# Altium project 10-Channel SPI Sensing Circuit.PrjPcb
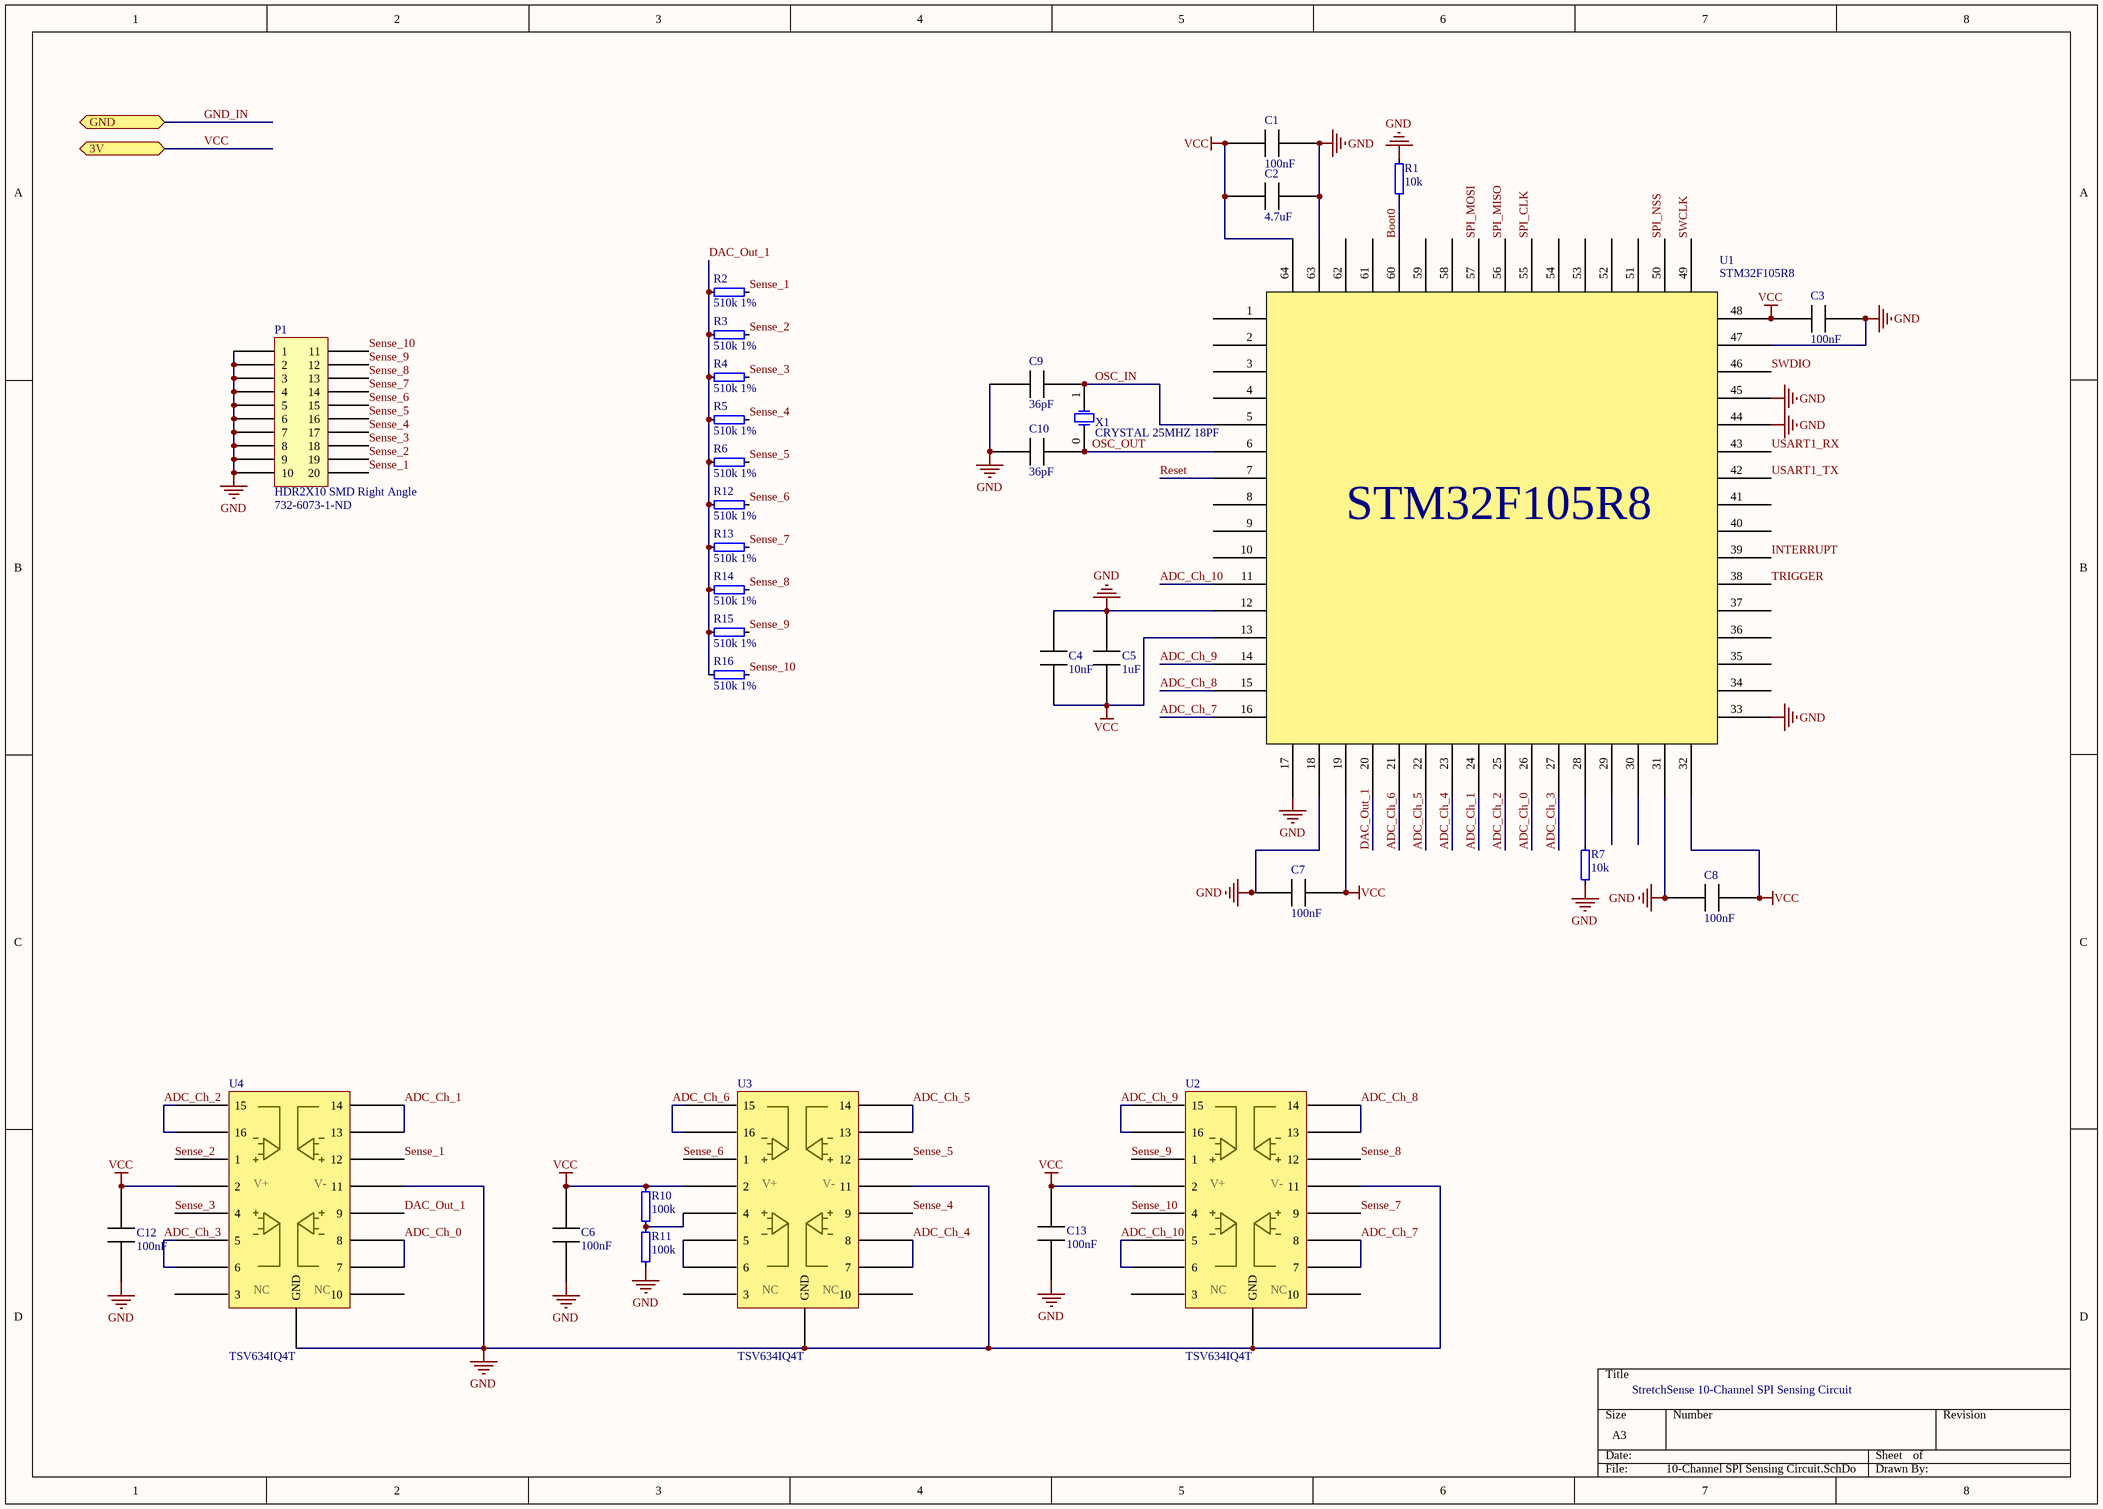
[diagram p0: 10-Channel SPI Sensing Circuit.SchDoc]
1 sheet, 32 parts. Net scope: flat (ports and power ports of the same name join across sheets).
Board file: 10-Channel SPI Sensing Circuit.PcbDoc

## Sheet 10-Channel SPI Sensing Circuit.SchDoc: StretchSense 10-Channel SPI Sensing Circuit
size A3; Revision: 1.0; PageSetup: Record=PageOptions|CenterHorizontal=True|CenterVertical=True|PrintScale=0.71|XCorrection=1.00|YCorrection=1.00|PrintKind=0|BorderSize=5000000|LeftOffset=0|BottomOffset=0|Orientation=2|PaperLength=1000|PaperWidth=1000|Scale=100|PaperSource=7|PrintQuality=600|MediaType=1|DitherType=10|PrintScaleMode=1|PaperKind=A4

### Parts
C1  100nF  [0402 Cap]
C2  4.7uF  [0402 Cap]
C3  100nF  [0402 Cap]
C4  10nF  [0402 Cap]
C5  1uF  [0402 Cap]
C6  100nF  [0402 Cap]
C7  100nF  [0402 Cap]
C8  100nF  [0402 Cap]
C9  36pF  [0402 Cap]
C10  36pF  [0402 Cap]
C12  100nF  [0402 Cap]
C13  100nF  [0402 Cap]
P1  HDR2X10 SMD Right Angle  Supplier Part Number 1: 732-6073-1-ND  [HDR2X10 SMD RIGHT]
R1  10k  [0402 Res]
R2  510k 1%  [0402 Res]
R3  510k 1%  [0402 Res]
R4  510k 1%  [0402 Res]
R5  510k 1%  [0402 Res]
R6  510k 1%  [0402 Res]
R7  10k  [0402 Res]
R10  100k  [0402 Res]
R11  100k  [0402 Res]
R12  510k 1%  [0402 Res]
R13  510k 1%  [0402 Res]
R14  510k 1%  [0402 Res]
R15  510k 1%  [0402 Res]
R16  510k 1%  [0402 Res]
U1  STM32F105R8  [STM32F105R8]
U2  TSV634IQ4T  [QFN-16]
U3  TSV634IQ4T  [QFN-16]
U4  TSV634IQ4T  [QFN-16]
X1  CRYSTAL 25MHZ 18PF  [CRYSTAL 24MHZ 18PF SMD]

### Ports
3V, GND

### Nets
GND: C1.2 C2.2 C3.2 C4.2 C5.1 C6.1 C7.1 C8.1 C9.2 C10.2 C12.1 C13.1 P1.1 P1.2 P1.3 P1.4 P1.5 P1.6 P1.7 P1.8 P1.9 P1.10 R1.1 R7.2 R11.1 U1.12(Pin12) U1.17(Pin17) U1.18(Pin18) U1.31(Pin31) U1.33(Pin33) U1.44(Pin44) U1.45(Pin45) U1.47(Pin47) U1.63(Pin63) U2.11 U2.17(GND) U3.11 U3.17(GND) U4.11 U4.17(GND)
VCC: C1.1 C2.1 C3.1 C4.1 C5.2 C6.2 C7.2 C8.2 C12.2 C13.2 R10.2 U1.13(Pin13) U1.19(Pin19) U1.32(Pin32) U1.48(Pin48) U1.64(Pin64) U2.2 U3.2 U4.2 ; port 3V
ADC_Ch_0: U1.26(Pin26) U4.7 U4.8
ADC_Ch_1: U1.24(Pin24) U4.13 U4.14
ADC_Ch_2: U1.25(Pin25) U4.15 U4.16
ADC_Ch_3: U1.27(Pin27) U4.5 U4.6
ADC_Ch_4: U1.23(Pin23) U3.7 U3.8
ADC_Ch_5: U1.22(Pin22) U3.13 U3.14
ADC_Ch_6: U1.21(Pin21) U3.15 U3.16
ADC_Ch_7: U1.16(Pin16) U2.7 U2.8
ADC_Ch_8: U1.15(Pin15) U2.13 U2.14
ADC_Ch_9: U1.14(Pin14) U2.15 U2.16
ADC_Ch_10: U1.11(Pin11) U2.5 U2.6
Boot0: R1.2 U1.60(Pin60)
DAC_Out_1: R2.2 R3.2 R4.2 R5.2 R6.2 R12.1 R13.1 R14.1 R15.1 R16.1 U1.20(Pin20) U4.9
GND_IN: port GND
INTERRUPT: U1.39(Pin39)
OSC_IN: C9.1 U1.5(Pin5) X1.1(OSC_IN)
OSC_OUT: C10.1 U1.6(Pin6) X1.0
Reset: U1.7(Pin7)
Sense_1: P1.20 R2.1 U4.12
Sense_2: P1.19 R3.1 U4.1
Sense_3: P1.18 R4.1 U4.4
Sense_4: P1.17 R5.1 U3.9
Sense_5: P1.16 R6.1 U3.12
Sense_6: P1.15 R12.2 U3.1
Sense_7: P1.14 R13.2 U2.9
Sense_8: P1.13 R14.2 U2.12
Sense_9: P1.12 R15.2 U2.1
Sense_10: P1.11 R16.2 U2.4
SPI_CLK: U1.55(Pin55)
SPI_MISO: U1.56(Pin56)
SPI_MOSI: U1.57(Pin57)
SPI_NSS: U1.50(Pin50)
SWCLK: U1.49(Pin49)
SWDIO: U1.46(Pin46)
TRIGGER: U1.38(Pin38)
USART1_RX: U1.43(Pin43)
USART1_TX: U1.42(Pin42)
NetR7_1: R7.1 U1.28(Pin28)
NetR10_1: R10.1 R11.2 U3.4
NetU3_5: U3.5 U3.6

Not connected (* = marked no-connect by the designer): U1 1(Pin1) 2(Pin2) 3(Pin3) 4(Pin4) 8(Pin8) 9(Pin9) 10(Pin10) 29(Pin29) 30(Pin30) 34(Pin34) 35(Pin35) 36(Pin36) 37(Pin37) 40(Pin40) 41(Pin41) 51(Pin51) 52(Pin52) 53(Pin53) 54(Pin54) 58(Pin58) 59(Pin59) 61(Pin61) 62(Pin62); U2 3 10; U3 3 10; U4 3 10

### Notes on the sheet
- (in symbol Quad Opamp TSV634IQ4T) V+; V-; NC

### Library data of the parts
C1 C3 C6-C8 C12 C13 = Cap 0402 100nF 10%: Capacitor; Manufacturer: Samsung Electro-Mechanics America, Inc.; Manufacturer Part Number: CL05B104KO5NNNC; Capacitance: 0.1µF; Tolerance: ±10%; Voltage - Rated: 16V; Temperature Coefficient: X7R; Supplier 1: Digi-Key; Supplier Part Number 1: 1276-1001-1-ND; RoHS: RoHS Compliant; Category: Capacitors; Stock 1: 2933888; Pricing 1: 1=0.17, 10=0.02, 25=0.014, 50=0.0106, 100=0.009, 500=0.0063, 1000=0.0049, 5000=0.00408 (NZD); Packaging: Cut Tape (CT); Mounting Type: Surface Mount, MLCC; Operating Temperature: -55°C ~ 125°C; Applications: General Purpose; Ratings: -; Package / Case: 0402 (1005 Metric); Size / Dimension: 0.039" L x 0.020" W (1.00mm x 0.50mm); Height - Seated (Max): -; Thickness (Max): 0.022" (0.55mm); Lead Spacing: -; Features: -; Lead Style: -; ComponentLink1URL: http://www.samsungsem.com/kr/support/product-search/mlcc/CL05B104KO5NNNC.jsp; ComponentLink1Description: http://www.samsungsem.com/kr/support/product-search/mlcc/CL05B104KO5NNNC.jsp
C2 = Cap 0402 4.7uF 10%: Capacitor; Manufacturer: TDK Corporation; Manufacturer Part Number: C1005X5R1A475K050BC; Capacitance: 4.7µF; Tolerance: ±10%; Voltage - Rated: 10V; Temperature Coefficient: X5R; Supplier 1: Digi-Key; Supplier Part Number 1: 445-13820-1-ND; RoHS: RoHS Compliant; Category: Capacitors; Stock 1: 646657; Pricing 1: 1=0.78, 10=0.685, 100=0.3427, 250=0.27412, 500=0.24966, 1000=0.22517, 5000=0.18601 (NZD); Packaging: Cut Tape (CT); Mounting Type: Surface Mount, MLCC; Operating Temperature: -55°C ~ 85°C; Applications: General Purpose; Ratings: -; Package / Case: 0402 (1005 Metric); Size / Dimension: 0.039" L x 0.020" W (1.00mm x 0.50mm); Height - Seated (Max): -; Thickness (Max): 0.022" (0.55mm); Lead Spacing: -; Features: Low ESL; Lead Style: -; ComponentLink1URL: https://product.tdk.com/info/en/catalog/datasheets/mlcc_commercial_general_en.pdf; ComponentLink1Description: https://product.tdk.com/info/en/catalog/datasheets/mlcc_commercial_general_en.pdf
C4 = Cap 0402 10nF 10%: Capacitor; Manufacturer: Samsung Electro-Mechanics America, Inc.; Manufacturer Part Number: CL05B103KA5NNNC; Capacitance: 10000pF; Tolerance: ±10%; Voltage - Rated: 25V; Temperature Coefficient: X7R; Supplier 1: Digi-Key; Supplier Part Number 1: 1276-1057-6-ND; RoHS: RoHS Compliant; Category: Capacitors; Stock 1: 279363; Pricing 1: 1=0.16, 25=0.0112, 50=0.0084, 100=0.0073, 500=0.0051, 1000=0.00397, 5000=0.00331 (NZD); Packaging: Digi-Reel®; Mounting Type: Surface Mount, MLCC; Operating Temperature: -55°C ~ 125°C; Applications: General Purpose; Ratings: -; Package / Case: 0402 (1005 Metric); Size / Dimension: 0.039" L x 0.020" W (1.00mm x 0.50mm); Height - Seated (Max): -; Thickness (Max): 0.022" (0.55mm); Lead Spacing: -; Features: -; Lead Style: -; ComponentLink1URL: http://www.samsungsem.com/kr/support/product-search/mlcc/CL05B103KA5NNNC.jsp; ComponentLink1Description: http://www.samsungsem.com/kr/support/product-search/mlcc/CL05B103KA5NNNC.jsp
C5 = Cap 0402 1uF 5%: Capacitor; Manufacturer: Samsung Electro-Mechanics America, Inc.; Manufacturer Part Number: CL05A105JQ5NNNC; Capacitance: 1µF; Tolerance: ±5%; Voltage - Rated: 6.3V; Temperature Coefficient: X5R; Supplier 1: Digi-Key; Supplier Part Number 1: 1276-1444-1-ND; RoHS: RoHS Compliant; Category: Capacitors; Stock 1: 406499; Pricing 1: 1=0.17, 10=0.042, 25=0.0292, 50=0.0224, 100=0.0188, 500=0.01322, 1000=0.01029, 5000=0.00857 (NZD); Packaging: Cut Tape (CT); Mounting Type: Surface Mount, MLCC; Operating Temperature: -55°C ~ 85°C; Applications: General Purpose; Ratings: -; Package / Case: 0402 (1005 Metric); Size / Dimension: 0.039" L x 0.020" W (1.00mm x 0.50mm); Height - Seated (Max): -; Thickness (Max): 0.022" (0.55mm); Lead Spacing: -; Features: -; Lead Style: -; ComponentLink1URL: http://www.samsungsem.com/kr/support/product-search/mlcc/CL05A105JQ5NNNC.jsp; ComponentLink1Description: http://www.samsungsem.com/kr/support/product-search/mlcc/CL05A105JQ5NNNC.jsp
C9 C10 = Cap 36pF 0402: Capacitor; Manufacturer: Samsung Electro-Mechanics America, Inc.; Manufacturer Part Number: CL05C360JB5NNNC; Tolerance: ±5%; Voltage - Rated: 50V; Temperature Coefficient: C0G, NP0; Supplier 1: Digi-Key; RoHS: RoHS Compliant; Category: Capacitors; Stock 1: 35043; Pricing 1: 1=0.17, 10=0.05, 25=0.0344, 50=0.0264, 100=0.0223, 500=0.01568, 1000=0.01221, 5000=0.01017 (NZD); Packaging: Cut Tape (CT); Capacitance: 36pF; Mounting Type: Surface Mount, MLCC; Operating Temperature: -55°C ~ 125°C; Applications: General Purpose; Ratings: -; Package / Case: 0402 (1005 Metric); Size / Dimension: 0.039" L x 0.020" W (1.00mm x 0.50mm); Height - Seated (Max): -; Thickness (Max): 0.022" (0.55mm); Lead Spacing: -; Features: -; Lead Style: -; ComponentLink1URL: http://www.samsungsem.com/kr/support/product-search/mlcc/CL05C360JB5NNNC.jsp; ComponentLink1Description: http://www.samsungsem.com/kr/support/product-search/mlcc/CL05C360JB5NNNC.jsp; Supplier Part Number 1: 1276-1686-1-ND
P1 = Header 2x10 SMD R/A 2.54mm: Header; Manufacturer: Wurth Electronics Inc; Manufacturer Part Number: 610120249121; Connector Type: Header, Unshrouded; Number of Positions: 20; Number of Positions Loaded: All; Pitch: 0.100" (2.54mm); Supplier 1: Digi-Key; RoHS: RoHS Compliant; Category: Connectors, Interconnects; Stock 1: 382; Pricing 1: 1=7.31, 50=6.8202, 100=6.3289 (NZD); Packaging: Cut Tape (CT); Contact Type: Male Pin; Number of Rows: 2; Row Spacing: 0.100" (2.54mm); Contact Mating Length: 0.236" (6.00mm); Mounting Type: Surface Mount, Right Angle; Termination: Solder; Fastening Type: -; Features: Board Guide; Contact Finish: Gold; Contact Finish Thickness: -; Color: Black; ComponentLink1URL: http://katalog.we-online.de/em/datasheet/6101xx249121.pdf; ComponentLink1Description: http://katalog.we-online.de/em/datasheet/6101xx249121.pdf
R1 R7 = Res 0402 10k 5%: Resistor; Manufacturer: Yageo; Manufacturer Part Number: RC0402JR-0710KL; Tolerance: ±5%; Power (Watts): 0.063W, 1/16W; Temperature Coefficient: ±100ppm/°C; Supplier 1: Digi-Key; Supplier Part Number 1: 311-10KJRCT-ND; RoHS: RoHS Compliant; Category: Resistors; Stock 1: 5424194; Pricing 1: 1=0.17, 10=0.02, 25=0.014, 100=0.0078, 250=0.006, 500=0.00482, 1000=0.00355, 2500=0.00308, 5000=0.00254 (NZD); Packaging: Cut Tape (CT); Resistance (Ohms): 10k; Composition: Thick Film; Features: Moisture Resistant; Operating Temperature: -55°C ~ 155°C; Package / Case: 0402 (1005 Metric); Supplier Device Package: 0402; Size / Dimension: 0.039" L x 0.020" W (1.00mm x 0.50mm); Height: 0.016" (0.40mm); Number of Terminations: 2; ComponentLink1URL: http://www.yageo.com/NewPortal/yageodocoutput?fileName=/pdf/R-Chip/PYu-RC_Group_51_RoHS_L_3.pdf; ComponentLink1Description: http://www.yageo.com/NewPortal/yageodocoutput?fileName=/pdf/R-Chip/PYu-RC_Group_51_RoHS_L_3.pdf
R2-R6 R12-R16 = Res 0402 510k 1%: Resistor; Manufacturer: Yageo; Manufacturer Part Number: RC0402FR-07510KL; Power (Watts): 0.063W, 1/16W; Temperature Coefficient: ±100ppm/°C; Supplier 1: Digi-Key; Supplier Part Number 1: 311-510KLRCT-ND; Resistance (Ohms): 510k; RoHS: RoHS Compliant; Category: Resistors; Stock 1: 141514; Pricing 1: 1=0.17, 10=0.022, 25=0.016, 100=0.0092, 250=0.00692, 500=0.00552, 1000=0.00406, 2500=0.00353, 5000=0.00292 (NZD); Packaging: Cut Tape (CT); Tolerance: ±1%; Composition: Thick Film; Features: Moisture Resistant; Operating Temperature: -55°C ~ 155°C; Package / Case: 0402 (1005 Metric); Supplier Device Package: 0402; Size / Dimension: 0.039" L x 0.020" W (1.00mm x 0.50mm); Height: 0.016" (0.40mm); Number of Terminations: 2; ComponentLink1URL: http://www.yageo.com/NewPortal/yageodocoutput?fileName=/pdf/R-Chip/PYu-RC_Group_51_RoHS_L_3.pdf; ComponentLink1Description: http://www.yageo.com/NewPortal/yageodocoutput?fileName=/pdf/R-Chip/PYu-RC_Group_51_RoHS_L_3.pdf
R10 R11 = Res 0402 100k 5%: Resistor; Manufacturer: Yageo; Manufacturer Part Number: RC0402FR-07100KL; Tolerance: ±1%; Power (Watts): 0.063W, 1/16W; Temperature Coefficient: ±100ppm/°C; Supplier 1: Digi-Key; RoHS: RoHS Compliant; Category: Resistors; Stock 1: 2686176; Pricing 1: 1=0.17, 10=0.022, 25=0.0164, 100=0.0093, 250=0.00708, 500=0.00564, 1000=0.00414, 2500=0.0036, 5000=0.00298 (NZD); Packaging: Cut Tape (CT); Resistance (Ohms): 100k; Composition: Thick Film; Features: Moisture Resistant; Operating Temperature: -55°C ~ 155°C; Package / Case: 0402 (1005 Metric); Supplier Device Package: 0402; Size / Dimension: 0.039" L x 0.020" W (1.00mm x 0.50mm); Height: 0.016" (0.40mm); Number of Terminations: 2; ComponentLink1URL: http://www.yageo.com/NewPortal/yageodocoutput?fileName=/pdf/R-Chip/PYu-RC_Group_51_RoHS_L_3.pdf; ComponentLink1Description: http://www.yageo.com/NewPortal/yageodocoutput?fileName=/pdf/R-Chip/PYu-RC_Group_51_RoHS_L_3.pdf; Supplier Part Number 1: 311-100KLRCT-ND
U1 = STM32F105R8: Microcontroller; Part: ST Microelectronics STM32F105R8; Manufacturer: STMicroelectronics; Manufacturer Part Number: STM32F105R8T6; Core Processor: ARM® Cortex®-M3; Core Size: 32-Bit; Speed: 72MHz; Connectivity: CAN, I²C, IrDA, LIN, SPI, UART/USART, USB OTG; Peripherals: DMA, POR, PWM, Voltage Detect, WDT; Number of I/O: 51; Program Memory Size: 64KB (64K x 8); Program Memory Type: FLASH; RAM Size: 64K x 8; Voltage - Supply (Vcc/Vdd): 2 V ~ 3.6 V; Data Converters: A/D 16x12b; D/A 2x12b; Oscillator Type: Internal; Supplier 1: Digi-Key; Supplier Part Number 1: 497-8922-ND; RoHS: RoHS Compliant; Category: Integrated Circuits (ICs); Stock 1: 1226; Pricing 1: 1=10.31, 10=9.287, 25=8.4396, 100=7.6244, 250=7.001, 500=6.3936, 1000=5.56242, 2500=5.35465 (NZD); Packaging: Tray; EEPROM Size: -; Operating Temperature: -40°C ~ 85°C; Package / Case: 64-LQFP; Supplier Device Package: *; ComponentLink1URL: http://www.st.com/web/en/resource/technical/document/datasheet/CD00220364.pdf; ComponentLink1Description: http://www.st.com/web/en/resource/technical/document/datasheet/CD00220364.pdf
U2-U4 = Quad Opamp TSV634IQ4T: Quad Opamp; Manufacturer: STMicroelectronics; Amplifier Type: General Purpose; Number of Circuits: 4; Output Type: Rail-to-Rail; Slew Rate: 0.34 V/µs; Gain Bandwidth Product: 880kHz; Current - Input Bias: 1pA; Voltage - Input Offset: 3mV; Current - Supply: 60µA; Current - Output / Channel: 74mA; Voltage - Supply, Single/Dual (±): 1.5 V ~ 5.5 V; Supplier 1: Digi-Key; Manufacturer Part Number: TSV634IQ4T; RoHS: RoHS Compliant; Category: Integrated Circuits (ICs); Stock 1: 1027; Pricing 1: 1=2.14, 10=1.916, 100=1.4933, 500=1.23494, 1000=0.97661 (NZD); Packaging: Cut Tape (CT); -3db Bandwidth: -; Operating Temperature: -40°C ~ 125°C; Mounting Type: Surface Mount; Package / Case: 16-VFQFN Exposed Pad; Supplier Device Package: 16-QFN (3x3); ComponentLink1URL: http://www.st.com/web/en/resource/technical/document/datasheet/CD00233973.pdf; ComponentLink1Description: http://www.st.com/web/en/resource/technical/document/datasheet/CD00233973.pdf; Supplier Part Number 1: 497-12823-1-ND
X1 = CRYSTAL 25MHZ 18PF SMD: 445C25D24M00000; Manufacturer: CTS-Frequency Controls; Manufacturer Part Number: 445C25D25M00000; Frequency Stability: ±50ppm; Frequency Tolerance: ±20ppm; ESR (Equivalent Series Resistance): 40 Ohm; Operating Mode: Fundamental; Supplier 1: Digi-Key; RoHS: RoHS Compliant; Category: Crystals and Oscillators; Stock 1: 7535; Pricing 1: 1=1.35, 10=1.203, 50=1.1238, 100=0.9946, 500=0.93986 (NZD); Packaging: Cut Tape (CT); Type: MHz Crystal; Frequency: 25MHz; Load Capacitance: 18pF; Operating Temperature: -20°C ~ 70°C; Ratings: -; Mounting Type: Surface Mount; Package / Case: 2-SMD; Size / Dimension: 0.197" L x 0.126" W (5.00mm x 3.20mm); Height: 0.053" (1.35mm); ComponentLink1URL: http://www.ctscorp.com/wp-content/uploads/2015/11/008-0360-0.pdf; ComponentLink1Description: http://www.ctscorp.com/wp-content/uploads/2015/11/008-0360-0.pdf; Supplier Part Number 1: CTX1167CT-ND